# Altium schematic sheet schema.SchDoc
size A4
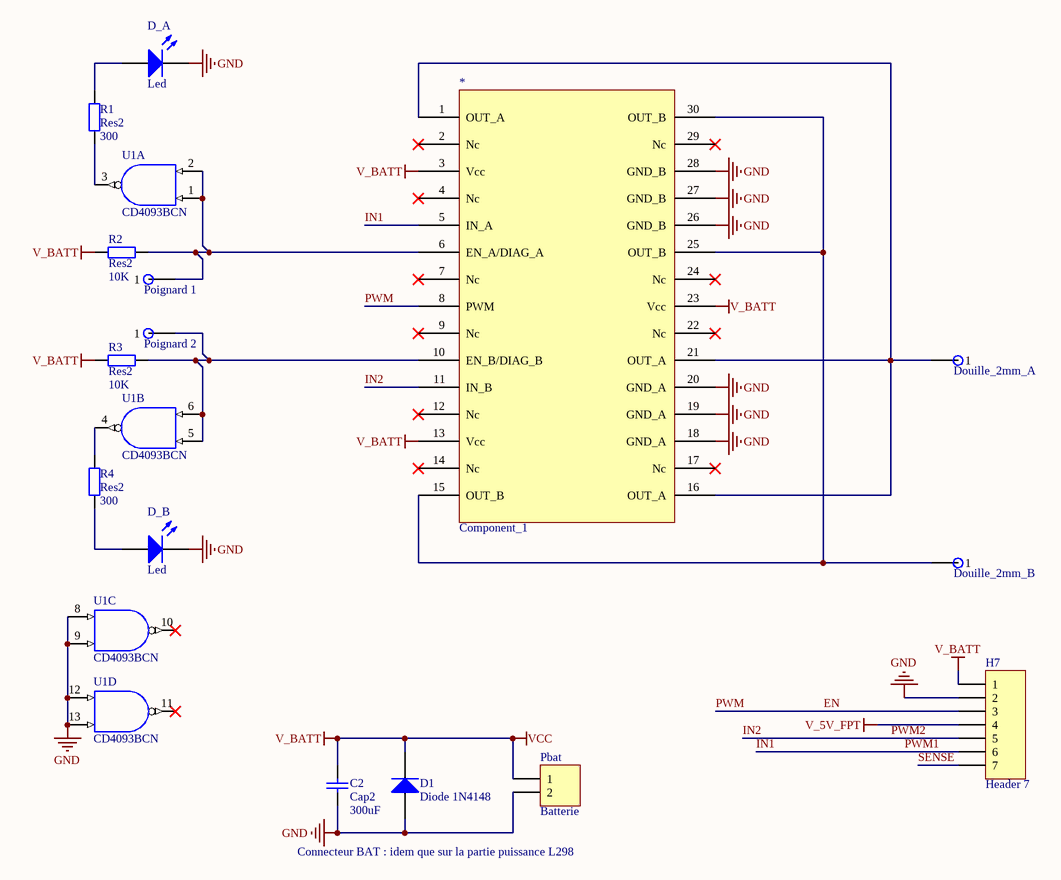
[diagram p0: schema.SchDoc]

## Parts
*  Component_1  [MultiPowerSO-30]
C2  Cap2  value 300uF  [CAPA2]
D1  Diode 1N4148  [Ddiode]
D_A  Led  [LED]
D_B  Led  [LED]
Douille_2mm_A  douille_2mm  [Douille-2mm]  (value not drawn)
Douille_2mm_B  douille_2mm  [Douille-2mm]  (value not drawn)
H7  Header 7  [HDR1X7]
Pbat  Batterie  [Bornier_2]
Poignard_1  Poignard  [Poignard]  (value not drawn)
Poignard_2  Poignard  [Poignard]  (value not drawn)
R1  Res2  value 300  [res5_1/4W]
R2  Res2  value 10K  [res5_1/4W]
R3  Res2  value 10K  [res5_1/4W]
R4  Res2  value 300  [res5_1/4W]
U1  CD4093BCN  [DIP14]  (parts A,B,C,D of 4)

## Nets
GND: *.18(GND_A) *.19(GND_A) *.20(GND_A) *.26(GND_B) *.27(GND_B) *.28(GND_B) C2.1 D1.1(A) D_A.2(K) D_B.2(K) H7.2 Pbat.2 U1.7(GND) U1.8(E) U1.9(F) U1.12(G) U1.13(H)
V_5V_FPT: H7.4
V_BATT: *.3(Vcc) *.13(Vcc) *.23(Vcc) C2.2 D1.2(K) H7.1 Pbat.1 R2.1 R3.1 U1.14(VCC)  [also labelled VCC]
EN: *.8(PWM) H7.3  [also labelled PWM]
IN1: *.5(IN_A) H7.6  [also labelled PWM1]
IN2: *.11(IN_B) H7.5  [also labelled PWM2]
SENSE: H7.7
Net*_1: *.1(OUT_A) *.16(OUT_A) *.21(OUT_A) Douille_2mm_A.1
Net*_6: *.6(EN_A/DIAG_A) Poignard_1.1 R2.2 U1.1(A) U1.2(B)
Net*_10: *.10(EN_B/DIAG_B) Poignard_2.1 R3.2 U1.5(C) U1.6(D)
Net*_15: *.15(OUT_B) *.25(OUT_B) *.30(OUT_B) Douille_2mm_B.1
NetD_A_1: D_A.1(A) R1.2
NetD_B_1: D_B.1(A) R4.1
NetR1_1: R1.1 U1.3(J)
NetR4_2: R4.2 U1.4(K)

Not connected (* = marked no-connect by the designer): * 2(Nc)* 4(Nc)* 7(Nc)* 9(Nc)* 12(Nc)* 14(Nc)* 17(Nc)* 22(Nc)* 24(Nc)* 29(Nc)*; U1 10(L)* 11(M)*

## Notes on the sheet
- Connecteur BAT : idem que sur la partie puissance L298

## Library data of the parts
C2 = Cap2: Capacitor; Published: 8-Jun-2000; LatestRevisionDate: 17-Jul-2002; LatestRevisionNote: Re-released for DXP Platform.; PackageReference: RAD-0.3; Publisher: Altium Limited
D1 = Diode 1N4148: High Conductance Fast Diode; pin to pad: 1>A 2>K; Published: 8-Jun-2000; LatestRevisionDate: 17-Jul-2002; LatestRevisionNote: Re-released for DXP Platform.; DatasheetDocument: 1997; PackageReference: DO-35; Publisher: Altium Limited; Code_JEDEC: DO-204-AH; ComponentLink1Description: Manufacturer Link; ComponentLink1URL: http://www.fairchildsemi.com/; ComponentLink2Description: Datasheet; ComponentLink2URL: http://www.fairchildsemi.com/ds/1N%2F1N4148.pdf
Douille_2mm_A Douille_2mm_B = douille_2mm: 1-Pin; LatestRevisionDate: 17-Jul-2002; LatestRevisionNote: Re-released for DXP Platform.; Publisher: Altium Limited
H7 = Header 7: Header, 7-Pin; LatestRevisionDate: 17-Jul-2002; LatestRevisionNote: Re-released for DXP Platform.; Publisher: Altium Limited
Pbat = Bornier_2: Header, 2-Pin; LatestRevisionDate: 17-Jul-2002; LatestRevisionNote: Re-released for DXP Platform.; Publisher: Altium Limited
R1-R4 = Res2: Resistor; Published: 8-Jun-2000; LatestRevisionDate: 17-Jul-2002; LatestRevisionNote: Re-released for DXP Platform.; PackageReference: AXIAL-0.4; Publisher: Altium Limited
U1 = CD4093BCN: Quad 2-Input NAND Schmitt Trigger; Published: 17-Jul-2002; LatestRevisionDate: 04-Mar-2005; LatestRevisionNote: Stylized 3D Model Added.; DatasheetVersion: Jan-1999; PackageVersion: 2000; PackageReference: N14A; Publisher: Altium Limited; PackageDescription: DIP; 14 Leads; Row Spacing 7.62 mm; Pitch 2.54 mm; ComponentLink1Description: Manufacturer Link; ComponentLink1URL: http://www.fairchildsemi.com/; ComponentLink2Description: Datasheet; ComponentLink2URL: http://www.fairchildsemi.com/ds/CD%2FCD4093BC.pdf
D_A D_B = Led: Published: 8-Jun-2000; LatestRevisionDate: 17-Jul-2002; LatestRevisionNote: Re-released for DXP Platform.; DatasheetDocument: 1998; PackageDocument: Aug-1999; PackageReference: DO-41; Publisher: Altium Limited; Code_JEDEC: DO-204-AL; ComponentLink1Description: Manufacturer Link; ComponentLink1URL: http://www.fairchildsemi.com/; ComponentLink2Description: Datasheet; ComponentLink2URL: http://www.fairchildsemi.com/ds/1N%2F1N4001.pdf
Poignard_1 Poignard_2 = Poignard: LatestRevisionDate: 17-Jul-2002; LatestRevisionNote: Re-released for DXP Platform.; Publisher: Altium Limited